# EAGLE schematic Haptic Sleeve Schematic (EAGLE 9.5.2)
DESIGNER: Grant Stankaitis
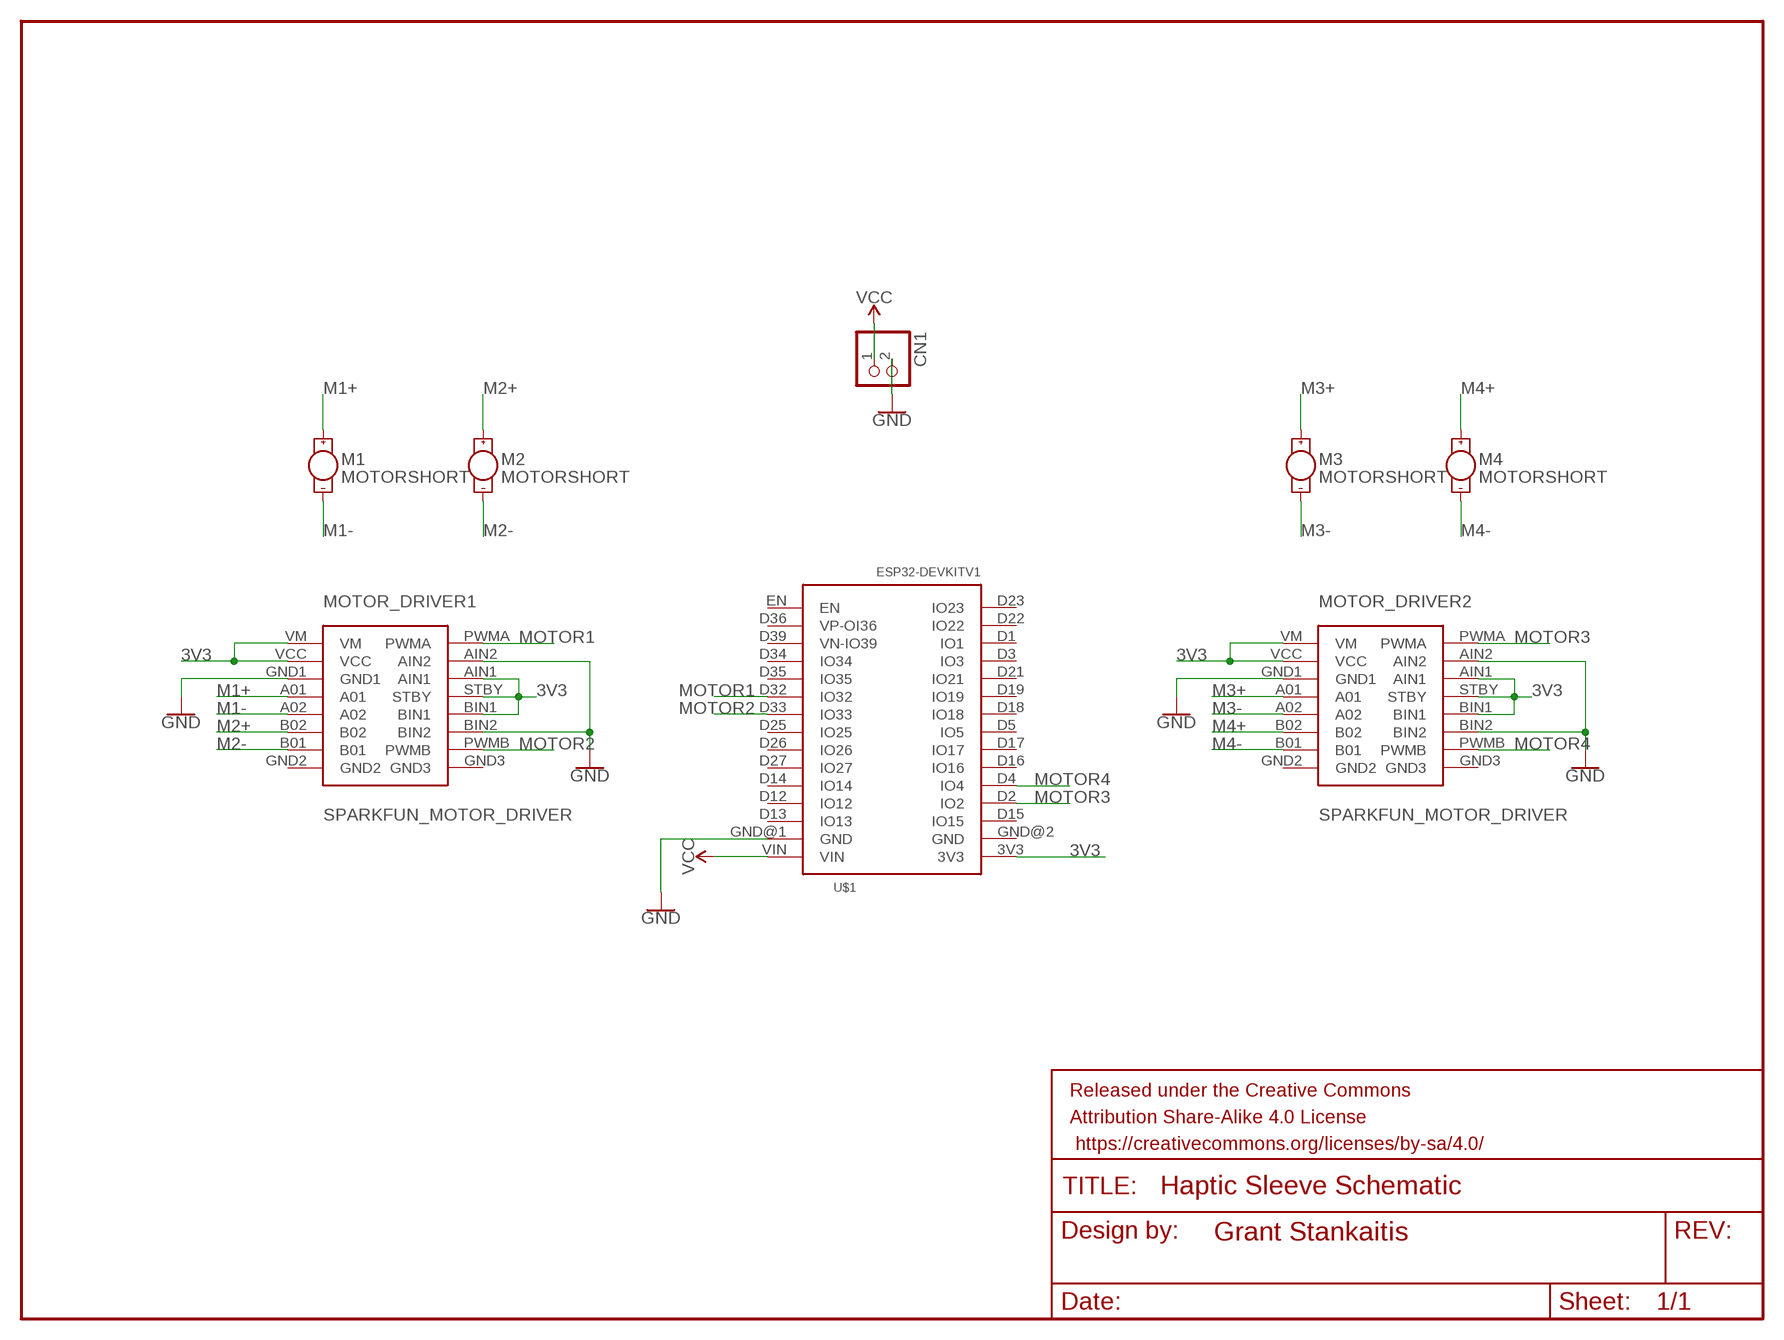
[diagram p0: schematic, sheet 1]

## Parts
CN1  JST_2PIN-THM-RA  [JST-PH-2-THM-RA]
FRAME1  FRAME-LETTERNO_PACKAGE  [DUMMY]
M1  MOTORSHORT  [VIBE-MOTOR-10MM-SMD]
M2  MOTORSHORT  [VIBE-MOTOR-10MM-SMD]
M3  MOTORSHORT  [VIBE-MOTOR-10MM-SMD]
M4  MOTORSHORT  [VIBE-MOTOR-10MM-SMD]
MOTOR_DRIVER1  SPARKFUN_MOTOR_DRIVER  [SPARKFUN_MOTOR_DRIVER]
MOTOR_DRIVER2  SPARKFUN_MOTOR_DRIVER  [SPARKFUN_MOTOR_DRIVER]
U$1  ESP32DEVKITV1  [ESP32-DEVKITV1]

## Nets
3V3: MOTOR_DRIVER1.AIN1 MOTOR_DRIVER1.BIN1 MOTOR_DRIVER1.STBY MOTOR_DRIVER1.VCC MOTOR_DRIVER1.VM MOTOR_DRIVER2.AIN1 MOTOR_DRIVER2.BIN1 MOTOR_DRIVER2.STBY MOTOR_DRIVER2.VCC MOTOR_DRIVER2.VM U$1.3V3
GND: CN1.2 MOTOR_DRIVER1.AIN2 MOTOR_DRIVER1.BIN2 MOTOR_DRIVER1.GND1 MOTOR_DRIVER2.AIN2 MOTOR_DRIVER2.BIN2 MOTOR_DRIVER2.GND1 U$1.GND@1(GND)
M1+: M1.+ MOTOR_DRIVER1.A01
M1-: M1.- MOTOR_DRIVER1.A02
M2+: M2.+ MOTOR_DRIVER1.B02
M2-: M2.- MOTOR_DRIVER1.B01
M3+: M3.+ MOTOR_DRIVER2.A01
M3-: M3.- MOTOR_DRIVER2.A02
M4+: M4.+ MOTOR_DRIVER2.B02
M4-: M4.- MOTOR_DRIVER2.B01
MOTOR1: MOTOR_DRIVER1.PWMA U$1.D32(IO32)
MOTOR2: MOTOR_DRIVER1.PWMB U$1.D33(IO33)
MOTOR3: MOTOR_DRIVER2.PWMA U$1.D2(IO2)
MOTOR4: MOTOR_DRIVER2.PWMB U$1.D4(IO4)
VCC: CN1.1 U$1.VIN
Unconnected: MOTOR_DRIVER1.GND2 MOTOR_DRIVER1.GND3 MOTOR_DRIVER2.GND2 MOTOR_DRIVER2.GND3 U$1.D1(IO1) U$1.D3(IO3) U$1.D5(IO5) U$1.D12(IO12) U$1.D13(IO13) U$1.D14(IO14) U$1.D15(IO15) U$1.D16(IO16) U$1.D17(IO17) U$1.D18(IO18) U$1.D19(IO19) U$1.D21(IO21) U$1.D22(IO22) U$1.D23(IO23) U$1.D25(IO25) U$1.D26(IO26) U$1.D27(IO27) U$1.D34(IO34) U$1.D35(IO35) U$1.D36(VP-OI36) U$1.D39(VN-IO39) U$1.EN U$1.GND@2(GND)

## Library data of the parts
CN1 = adafruit:JST_2PIN: JST 2-Pin Connectors of various flavors SMT-RA (S2B-PH-SM4) 4UConnector #17311 SMT (B2B-PH-SM4) THM-RA (S2B-PH) THM (B2B-PH)
FRAME1 = SparkFun-Aesthetics:FRAME-LETTER: Schematic Frame - Letter Standard 8.5x11 US Letter frame; DESIGNER: Grant Stankaitis; VERSION: v01
M1-M4 = SparkFun-MotorDriver:MOTOR: Motor (Single-Phase) Two-terminal, single-phase motors. SparkFun Products Vibration Motor <https://www.sparkfun.com/products/8449> (ROB-08449) Physical dimension and wire connections for this powerful vibration motor. Motor has a self adhesive backing.; PROD_ID: COMP-13709
MOTOR_DRIVER1 MOTOR_DRIVER2 = SparkFun-MotorDriver:SPARKFUN_MOTOR_DRIVER
U$1 = ESP32-DEVKITV1:ESP32DEVKITV1